# EAGLE schematic OpenFocus (EAGLE 5.11)
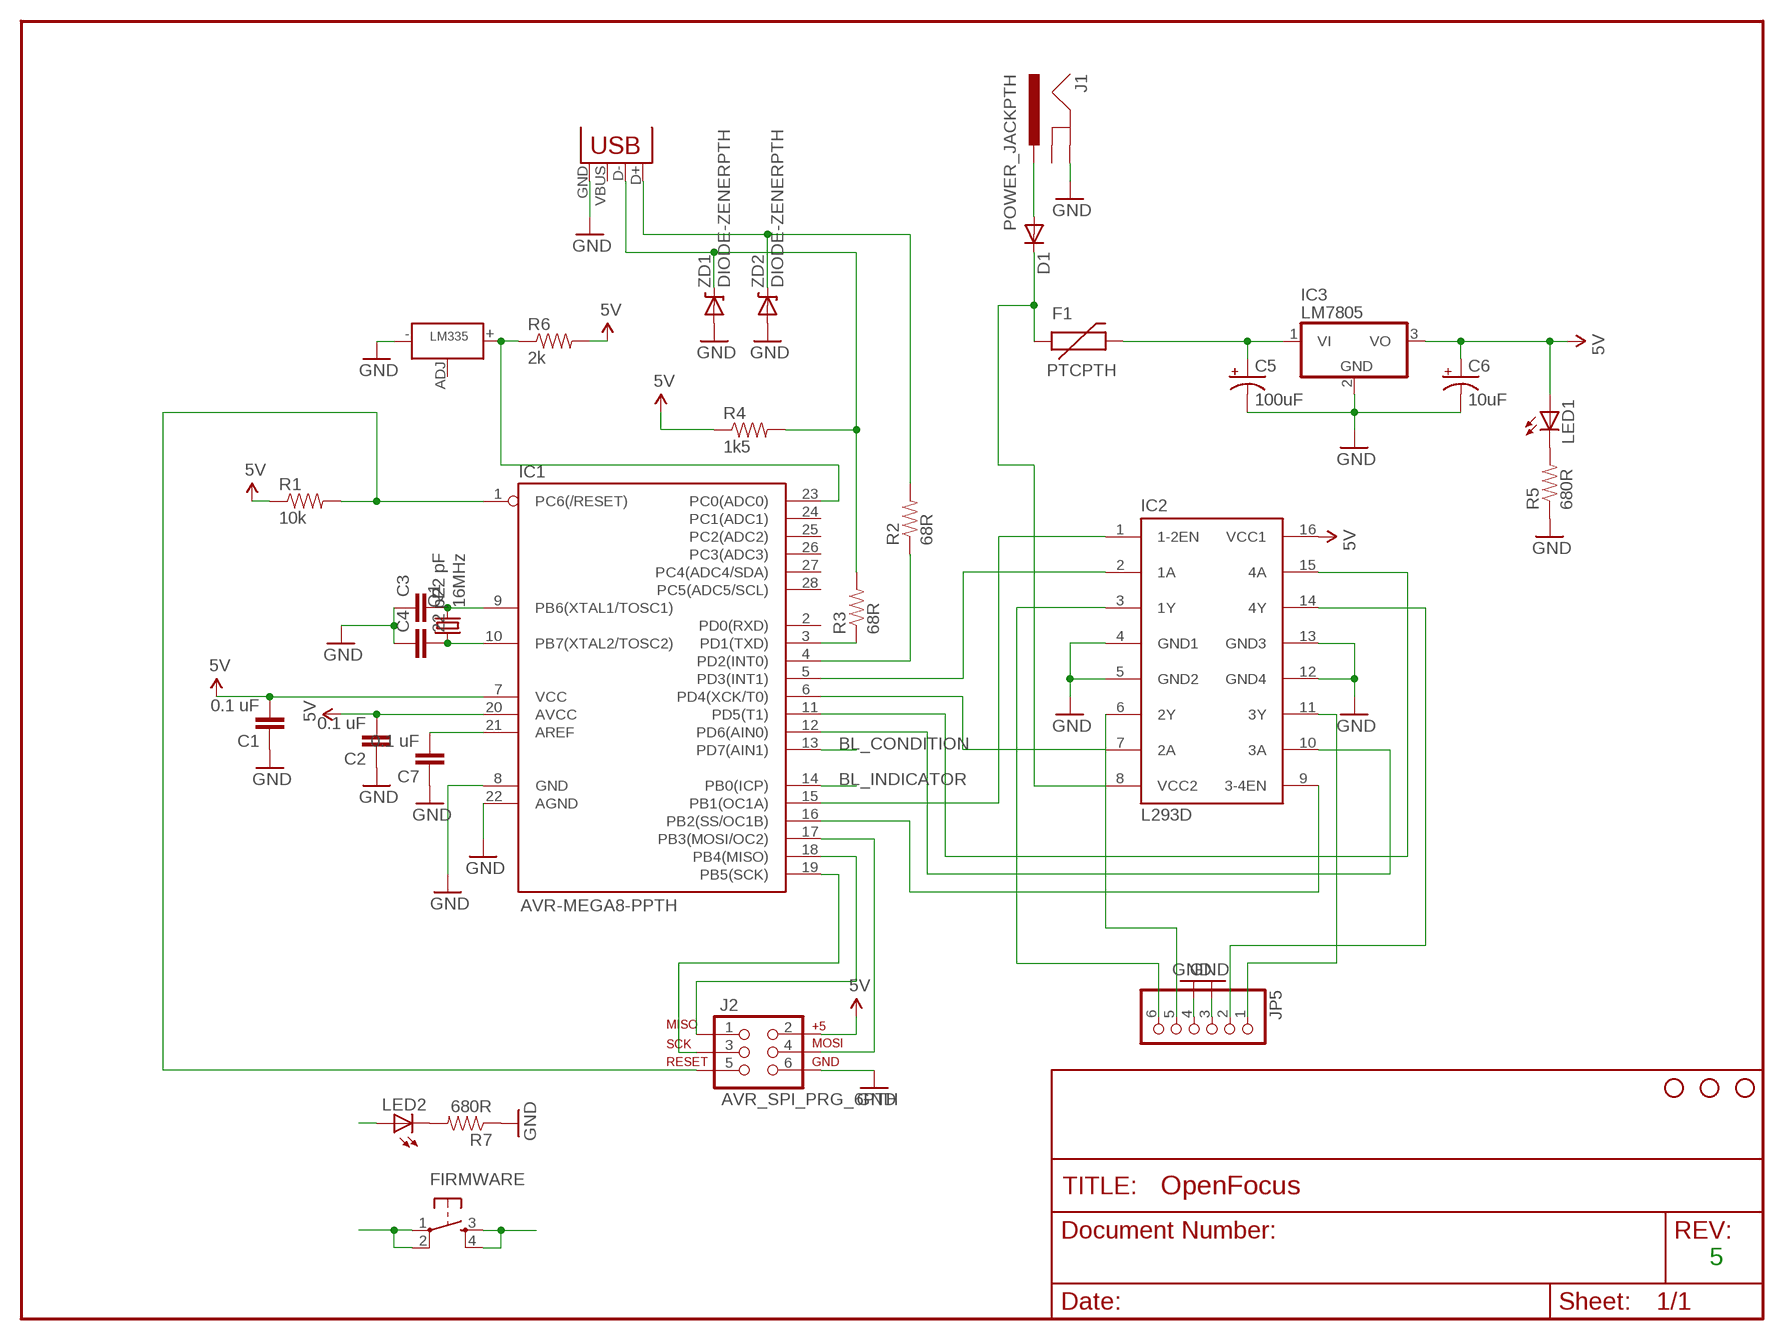
[diagram p0: schematic, sheet 1]

## Parts
C1  0.1 uF  CAPPTH  [CAP-PTH-SMALL]
C2  0.1 uF  CAPPTH  [CAP-PTH-SMALL]
C3  22 pF  CAPPTH  [CAP-PTH-SMALL]
C4  22 pF  CAPPTH  [CAP-PTH-SMALL]
C5  100uF  CAP_POLPTH1  [CPOL-RADIAL-100UF-25V]
C6  10uF  CAP_POLPTH2  [CPOL-RADIAL-10UF-25V]
C7  0.1 uF  CAPPTH  [CAP-PTH-SMALL]
D1  DIODE1N4148  [DIODE-1N4148]
F1  PTCPTH  [PTC]
FIRMWARE  TAC_SWITCHPTH  [TACTILE-PTH]
IC1  AVR-MEGA8-PPTH  [DIL28-3]
IC2  L293D  [DIL16]
IC3  LM7805  7805T  [TO220H]
J1  POWER_JACKPTH  [POWER_JACK_PTH]
J2  AVR_SPI_PRG_6PTH  [2X3]
JP2  STAND-OFF  [STAND-OFF]
JP3  STAND-OFF  [STAND-OFF]
JP4  STAND-OFF  [STAND-OFF]
JP5  PINHD-1X6  [1X06]
LED1  LED3MM  [LED3MM]
LED2  LED1206  [LED-1206]
Q1  16MHz  CRYSTALHC49US  [HC49US]
R1  10k  RESISTORPTH1  [AXIAL-0.3]
R2  68R  RESISTORPTH1  [AXIAL-0.3]
R3  68R  RESISTORPTH1  [AXIAL-0.3]
R4  1k5  RESISTORPTH1  [AXIAL-0.3]
R5  680R  RESISTORPTH1  [AXIAL-0.3]
R6  2k  RESISTORPTH1  [AXIAL-0.3]
R7  680R  RESISTOR1206  [1206]
U$8  LM335A  [TO-92-3]
X2  USBPTH  [USB-B-PTH]
ZD1  DIODE-ZENERPTH  [DIODE-ZENER]
ZD2  DIODE-ZENERPTH  [DIODE-ZENER]

## Nets
5V: C1.2 C2.2 C6.1(+) IC1.7(VCC) IC1.20(AVCC) IC2.16(VCC1) IC3.3(VO) J2.2 LED1.A R1.P$1 R4.P$1 R6.P$2
12V: D1.C F1.P$1 IC2.8(VCC2)
BL_CONDITION: FIRMWARE.1 FIRMWARE.2 IC1.13(PD7(AIN1))
BL_INDICATOR: IC1.14(PB0(ICP)) LED2.A
GND: C1.1 C2.1 C3.1 C4.1 C5.2(-) C6.2(-) C7.1 FIRMWARE.3 FIRMWARE.4 IC1.8(GND) IC1.22(AGND) IC2.4(GND1) IC2.5(GND2) IC2.12(GND4) IC2.13(GND3) IC3.2(GND) J1.GND J2.6 JP5.3 JP5.4 R5.P$1 R7.1 U$8.- X2.GND ZD1.P$2(A) ZD2.P$2(A)
N$1: C7.2 IC1.21(AREF)
N$2: IC1.23(PC0(ADC0)) R6.P$1 U$8.+
N$3: IC2.3(1Y) JP5.6
N$4: C3.2 IC1.9(PB6(XTAL1/TOSC1)) Q1.2
N$5: C4.2 IC1.10(PB7(XTAL2/TOSC2)) Q1.1
N$6: IC2.6(2Y) JP5.5
N$7: LED2.C R7.2
N$8: IC2.14(4Y) JP5.2
N$9: IC2.11(3Y) JP5.1
N$10: C5.1(+) F1.P$2 IC3.1(VI)
N$11: IC1.19(PB5(SCK)) J2.3
N$13: IC1.17(PB3(MOSI/OC2)) J2.4
N$14: R3.P$2 R4.P$2 X2.D- ZD1.P$1(C)
N$15: R2.P$2 X2.D+ ZD2.P$1(C)
N$16: IC1.3(PD1(TXD)) R3.P$1
N$17: IC1.4(PD2(INT0)) R2.P$1
N$18: IC1.18(PB4(MISO)) J2.1
N$20: IC1.1(PC6(/RESET)) J2.5 R1.P$2
N$21: IC1.5(PD3(INT1)) IC2.2(1A)
N$22: IC1.6(PD4(XCK/T0)) IC2.7(2A)
N$23: IC1.11(PD5(T1)) IC2.15(4A)
N$24: IC1.12(PD6(AIN0)) IC2.10(3A)
N$25: IC1.15(PB1(OC1A)) IC2.1(1-2EN)
N$26: IC1.16(PB2(SS/OC1B)) IC2.9(3-4EN)
N$27: LED1.K(C) R5.P$2
N$28: D1.A J1.PWR
Unconnected: IC1.2(PD0(RXD)) IC1.24(PC1(ADC1)) IC1.25(PC2(ADC2)) IC1.26(PC3(ADC3)) IC1.27(PC4(ADC4/SDA)) IC1.28(PC5(ADC5/SCL)) J1.GNDBREAK U$8.ADJ X2.VBUS

## Notes on the sheet
- 5

## Library data of the parts
C1-C4 C7 = SparkFun:CAP: Capacitor Standard 0603 ceramic capacitor, and 0.1" leaded capacitor.
C5 C6 = SparkFun:CAP_POL: Capacitor Polarized These are standard SMD and PTH capacitors. Normally 10uF, 47uF, and 100uF in electrolytic and tantalum varieties. Always verify the external diameter of the through hole cap, it varies with capacity, voltage, and manufacturer. The EIA devices should be standard.
D1 = SparkFun:DIODE: Diode These are standard reverse protection diodes and small signal diodes. SMA package can handle up to about 1A. SOD-323 can handle about 200mA. What the SOD-323 package when ordering, there are some mfgs out there that are 5-pin packages.
F1 = SparkFun:PTC: Resettable Fuse PTC Resettable Fuse. Spark Fun Electronics SKU : COM-08357
FIRMWARE = SparkFun:TAC_SWITCH: Momentary Switch Button commonly used for reset or general input. Spark Fun Electronics SKU : COM-00097
IC1 = SparkFun:AVR-MEGA8-P: MICROCONTROLLER 8 Kbytes FLASH 1 kbytes SRAM 512 bytes EEPROM USART 4-channel 10 bit ADC 2-channel 8 bit ADC
IC2 = st-microelectronics:L293D: PUSH-PULL 4 CHANNEL DRIVER
IC3 = linear:78*: Positive VOLTAGE REGULATOR Source: http://cache.national.com/ds/LM/LM78L05.pdf http://www.fairchildsemi.com/ds/LM/LM7805.pdf
J1 = SparkFun:POWER_JACK: Power Jack This is the standard 5.5mm barrel jack for power. The PTH is the most common, proven, reliable, footprint. All others are experimental. The Slot footprint only works if the mill layer is transmitted to the PCB fab house so be warned. Spark Fun Electronics SKU : PRT-00119. Mating wall wart : TOL-00298 (and others)
J2 = SparkFun:AVR_SPI_PRG_6: AVR ISP 6 Pin This is the reduced ISP connector for AVR programming. Common on Arduino. This footprint will take up less PCB space and can be used with a 10-pin to 6-pin adapter such as SKU: BOB-08508
JP2-JP4 = SparkFun:STAND-OFF: Stand Off This is the mechanical footprint for a #4 phillips button head screw. Use the keepout ring to avoid running the screw head into surrounding components. SKU : PRT-00447
JP5 = pinhead:PINHD-1X6: PIN HEADER
LED1 LED2 = SparkFun:LED: LEDs Standard schematic elements and footprints for 5mm, 3mm, 1206, and 0603 sized LEDs. 5mm - Spark Fun Electronics SKU : COM-00529 (and others)
Q1 = SparkFun:CRYSTAL: Crystals Various standard crystals. Proven footprints. Spark Fun Electronics SKU : COM-00534
R1-R7 = SparkFun:RESISTOR: Resistor Basic schematic elements and footprints for 0603, 1206, and PTH 1/10th watt (small) resistors.
U$8 = EJH:LM335A
X2 = SparkFun:USB: USB Connectors USB-B-PTH is fully proven SKU : PRT-00139 USB-miniB is fully proven SKU : PRT-00587 USB-A-PCB is untested. USB-A-H is throughly reviewed, but untested. Spark Fun Electronics SKU : PRT-00437 USB-B-SMT is throughly reviewed, but untested. Needs silkscreen touching up. USB-A-S has not been used/tested USB-MB-H has not been used/tested
ZD1 ZD2 = SparkFun:DIODE-ZENER: Zener Diode Production Part - 8199 3.4V Zener Voltage